# Altium schematic sheet Pic-Kit.SchDoc
size 420 x 297 mm; Address1: Address1; Address2: Address2; Address3: Address3; Address4: Address4; DocumentNumber: АБВГ.123456.001 Э3; SheetNumber: 1; SheetTotal: 1; Scale: 1:1; DocumentType: Схема электрическая принципиальная; FirstReferrence: АБВГ.123456.001
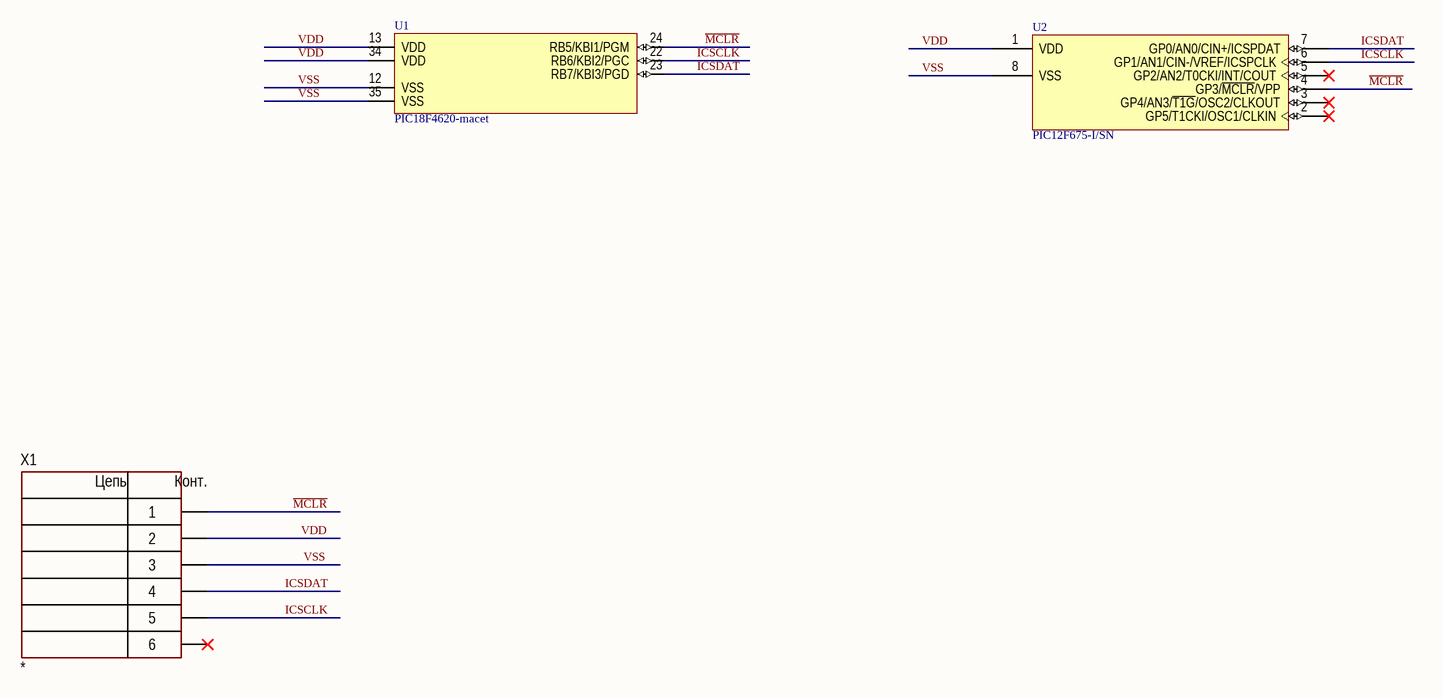
[diagram p0: Pic-Kit.SchDoc]

## Parts
U1  PIC18F4620-macet  [PDIP600-P44]
U2  PIC12F675-I/SN  [PDIP300-P8]
X1  *  [CON: PAD 6]

## Nets
ICSCLK: U1.22(RB6/KBI2/PGC) U2.6(GP1/AN1/CIN-/VREF/ICSPCLK) X1.5
ICSDAT: U1.23(RB7/KBI3/PGD) U2.7(GP0/AN0/CIN+/ICSPDAT) X1.4
~{MCLR}: U1.24(RB5/KBI1/PGM) U2.4(GP3/~{MCLR}/VPP) X1.1
VDD: U1.13(VDD) U1.34(VDD) U2.1(VDD) X1.2
VSS: U1.12(VSS) U1.35(VSS) U2.8(VSS) X1.3

Not connected (* = marked no-connect by the designer): U2 2(GP5/T1CKI/OSC1/CLKIN)* 3(GP4/AN3/~{T1G}/OSC2/CLKOUT)* 5(GP2/AN2/T0CKI/INT/COUT)*; X1 6*

## Notes on the sheet
- Перв. примен.
- Справ. №
- Подп. и дата
- Инв. № дубл.
- Взам. инв. №
- Разраб.
- Изм.
- Лист
- № докум.
- Подп.
- Дата
- Лит.
- Масса
- Масштаб
- Пров.
- Т.контр.
- Листов
- Инв. № подл.
- Утв.
- Н.контр.
- 2.106-A3
- Копировал
- Формат А3
- (in symbol 6-Connector) Цепь; Конт.

## Library data of the parts
U1 = PIC18F4620-macet: 44-Pin PDIP; PackageDescription: 40-Lead Plastic Dual In-Line (P) - 600 mil Body [PDIP]; PackageVersion: revBB, Aug-2009; DatasheetVersion: revE, May-2008; PackageReference: PDIP600-P40
U2 = PIC12F675-I/SN: FLASH-Based 8-Bit CMOS Microcontroller, 10-Bit A/D, 8-Pin SOIC 150mil, Industrial Temperature; Note1: Refer to data sheet (DS41190F) for details of supply voltage range under different conditions.; DatasheetVersion: revF, Sep-2009; PackageDescription: 8-Lead Plastic Small Outline (SN) - Narrow, 3.90mm Body [SOIC]; Code_JEDEC: MS-012; PackageVersion: revBB, Aug-2009; Code_IPC: SOIC127P600-8; PackageReference: SOIC-SN8
X1 = 6-Connector: Model: *; Manufacturer: *; HelpURL: *; ComponentKind: *